# EAGLE schematic The Flying Jalapeno DUMMY v01 (EAGLE 7.3.0)

## Sheet 1 of 2
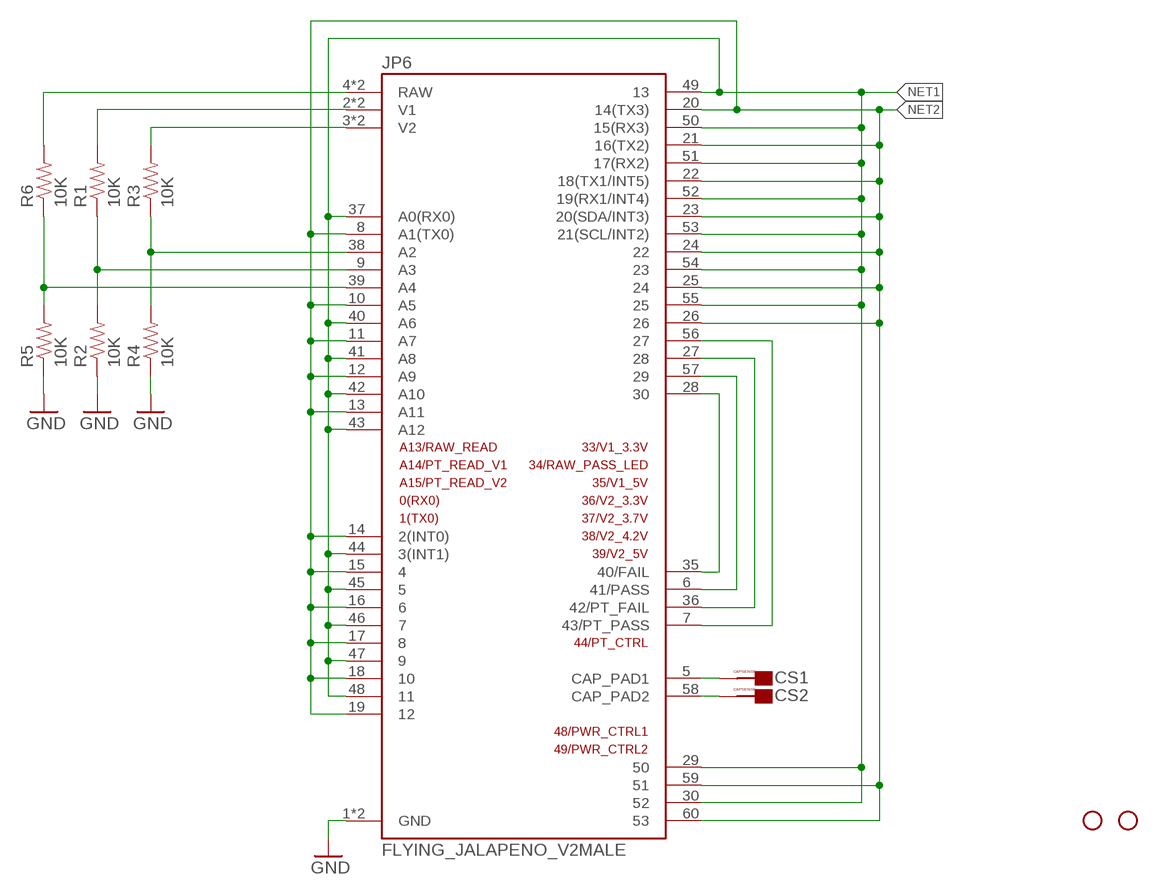
[diagram p0: schematic, sheet 1]

### Parts
CS1  CAPSENSE_BUTTON_PAD_ONLY  [CAPSENSE_BUTTON_PADS_ONLY]
CS2  CAPSENSE_BUTTON_PAD_ONLY  [CAPSENSE_BUTTON_PADS_ONLY]
JP6  FLYING_JALAPENO_V2MALE  [FLYING_JALAPENO_V2_M]
R1  10K  10KOHM-1/10W-1%(0603)0603  [0603-RES]
R2  10K  10KOHM-1/10W-1%(0603)0603  [0603-RES]
R3  10K  10KOHM-1/10W-1%(0603)0603  [0603-RES]
R4  10K  10KOHM-1/10W-1%(0603)0603  [0603-RES]
R5  10K  10KOHM-1/10W-1%(0603)0603  [0603-RES]
R6  10K  10KOHM-1/10W-1%(0603)0603  [0603-RES]
STANDOFF1  STAND-OFFTIGHT  [STAND-OFF-TIGHT]
STANDOFF2  STAND-OFFTIGHT  [STAND-OFF-TIGHT]

### Nets
GND: JP6.1(GND) JP6.31(GND) R2.1 R4.1 R5.1
N$1: JP6.39(A4) R5.2 R6.1
N$2: JP6.4(RAW) JP6.34(RAW) R6.2
N$3: CS2.CAPSENSE_PAD(CAPSENSE) JP6.58(CAP_PAD2)
N$4: CS1.CAPSENSE_PAD(CAPSENSE) JP6.5(CAP_PAD1)
N$5: JP6.2(V1) JP6.32(V1) R1.2
N$6: JP6.9(A3) R1.1 R2.2
N$7: JP6.3(V2) JP6.33(V2) R3.2
N$8: JP6.38(A2) R3.1 R4.2
N$9: JP6.28 JP6.35(40/FAIL)
N$10: JP6.6(41/PASS) JP6.57
N$11: JP6.27 JP6.36(42/PT_FAIL)
N$12: JP6.7(43/PT_PASS) JP6.56
NET1: JP6.29 JP6.30 JP6.37(A0(RX0)) JP6.40(A6) JP6.41(A8) JP6.42(A10) JP6.43(A12) JP6.44(3(INT1)) JP6.45 JP6.46 JP6.47 JP6.48 JP6.49 JP6.50(15(RX3)) JP6.51(17(RX2)) JP6.52(19(RX1/INT4)) JP6.53(21(SCL/INT2)) JP6.54 JP6.55
NET2: JP6.8(A1(TX0)) JP6.10(A5) JP6.11(A7) JP6.12(A9) JP6.13(A11) JP6.14(2(INT0)) JP6.15 JP6.16 JP6.17 JP6.18 JP6.19 JP6.20(14(TX3)) JP6.21(16(TX2)) JP6.22(18(TX1/INT5)) JP6.23(20(SDA/INT3)) JP6.24 JP6.25 JP6.26 JP6.59 JP6.60

## Sheet 2 of 2
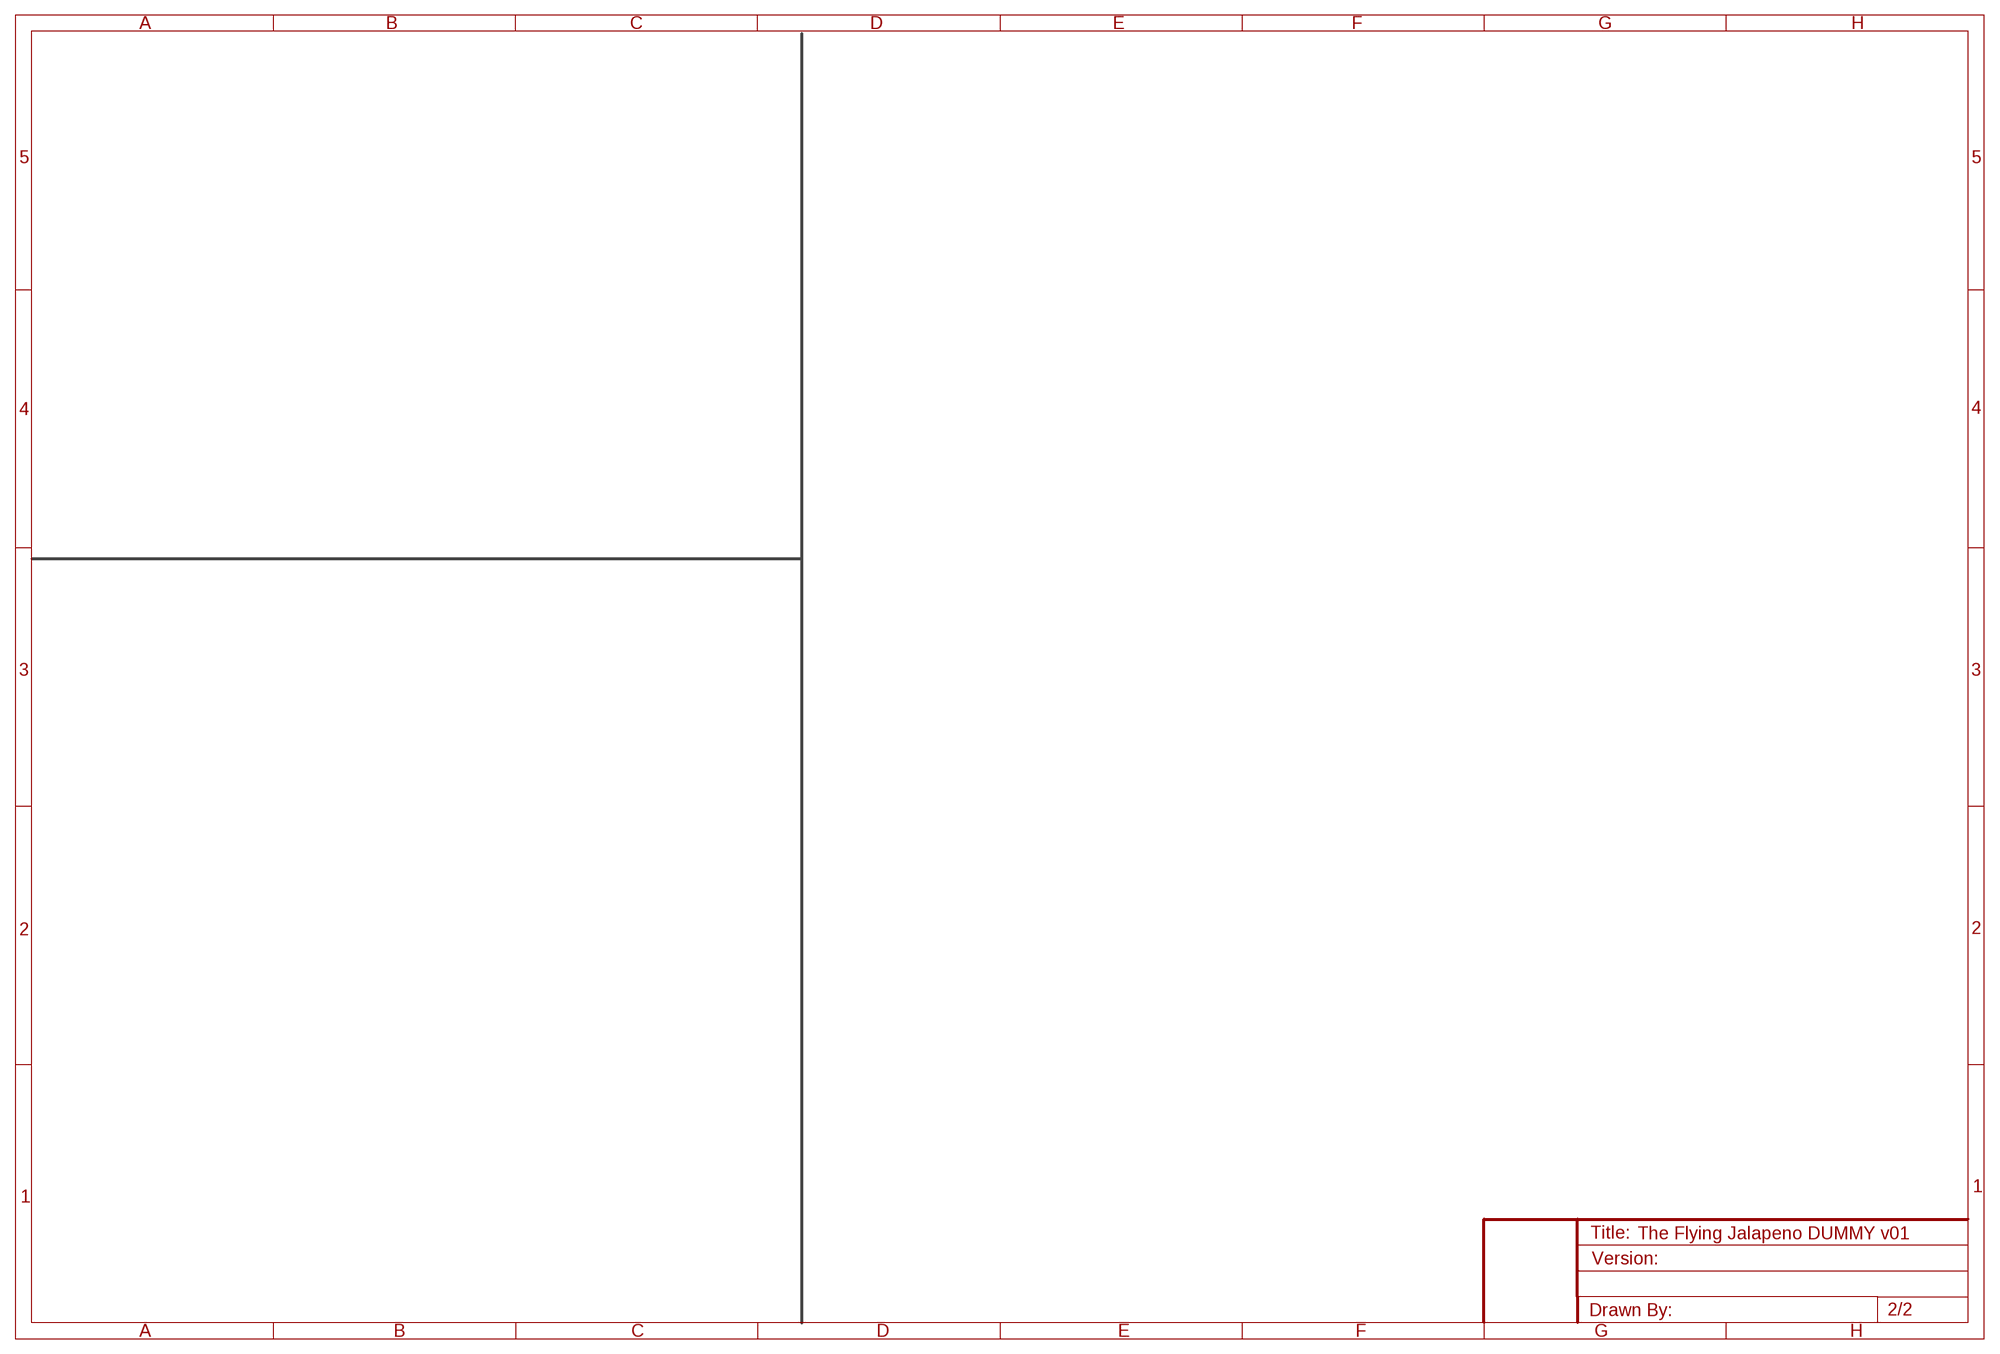
[diagram p1: schematic, sheet 2]

## Library data of the parts
CS1 CS2 = SparkFun:CAPSENSE_BUTTON_PAD_ONLY
JP6 = SparkFun:FLYING_JALAPENO_V2
R1-R6 = SparkFun-Resistors:10KOHM-1/10W-1%(0603): RES-00824; PROD_ID: RES-00824
STANDOFF1 STANDOFF2 = SparkFun-Electromechanical:STAND-OFF: #4 Stand Off This is the mechanical footprint for a #4 phillips button head screw. Use the keepout ring to avoid running the screw head into surrounding components. SKU : PRT-00447

## Net classes
0 default: width 0.203 mm
8 8_mil: width 0.203 mm, drill 0.381 mm
9 10_mil: width 0.254 mm, drill 0.381 mm
10 12_mil: width 0.305 mm, drill 0.381 mm
11 15_mil: width 0.381 mm, drill 0.381 mm
12 18_mil: width 0.457 mm, drill 0.508 mm
13 20_mil: width 0.508 mm, drill 0.508 mm
14 30_mil: width 0.762 mm, drill 0.508 mm